# EAGLE design ColorNodeV1.1 (EAGLE 6.3)
ABBREV: jn5; PROJECT: JeeNode v5
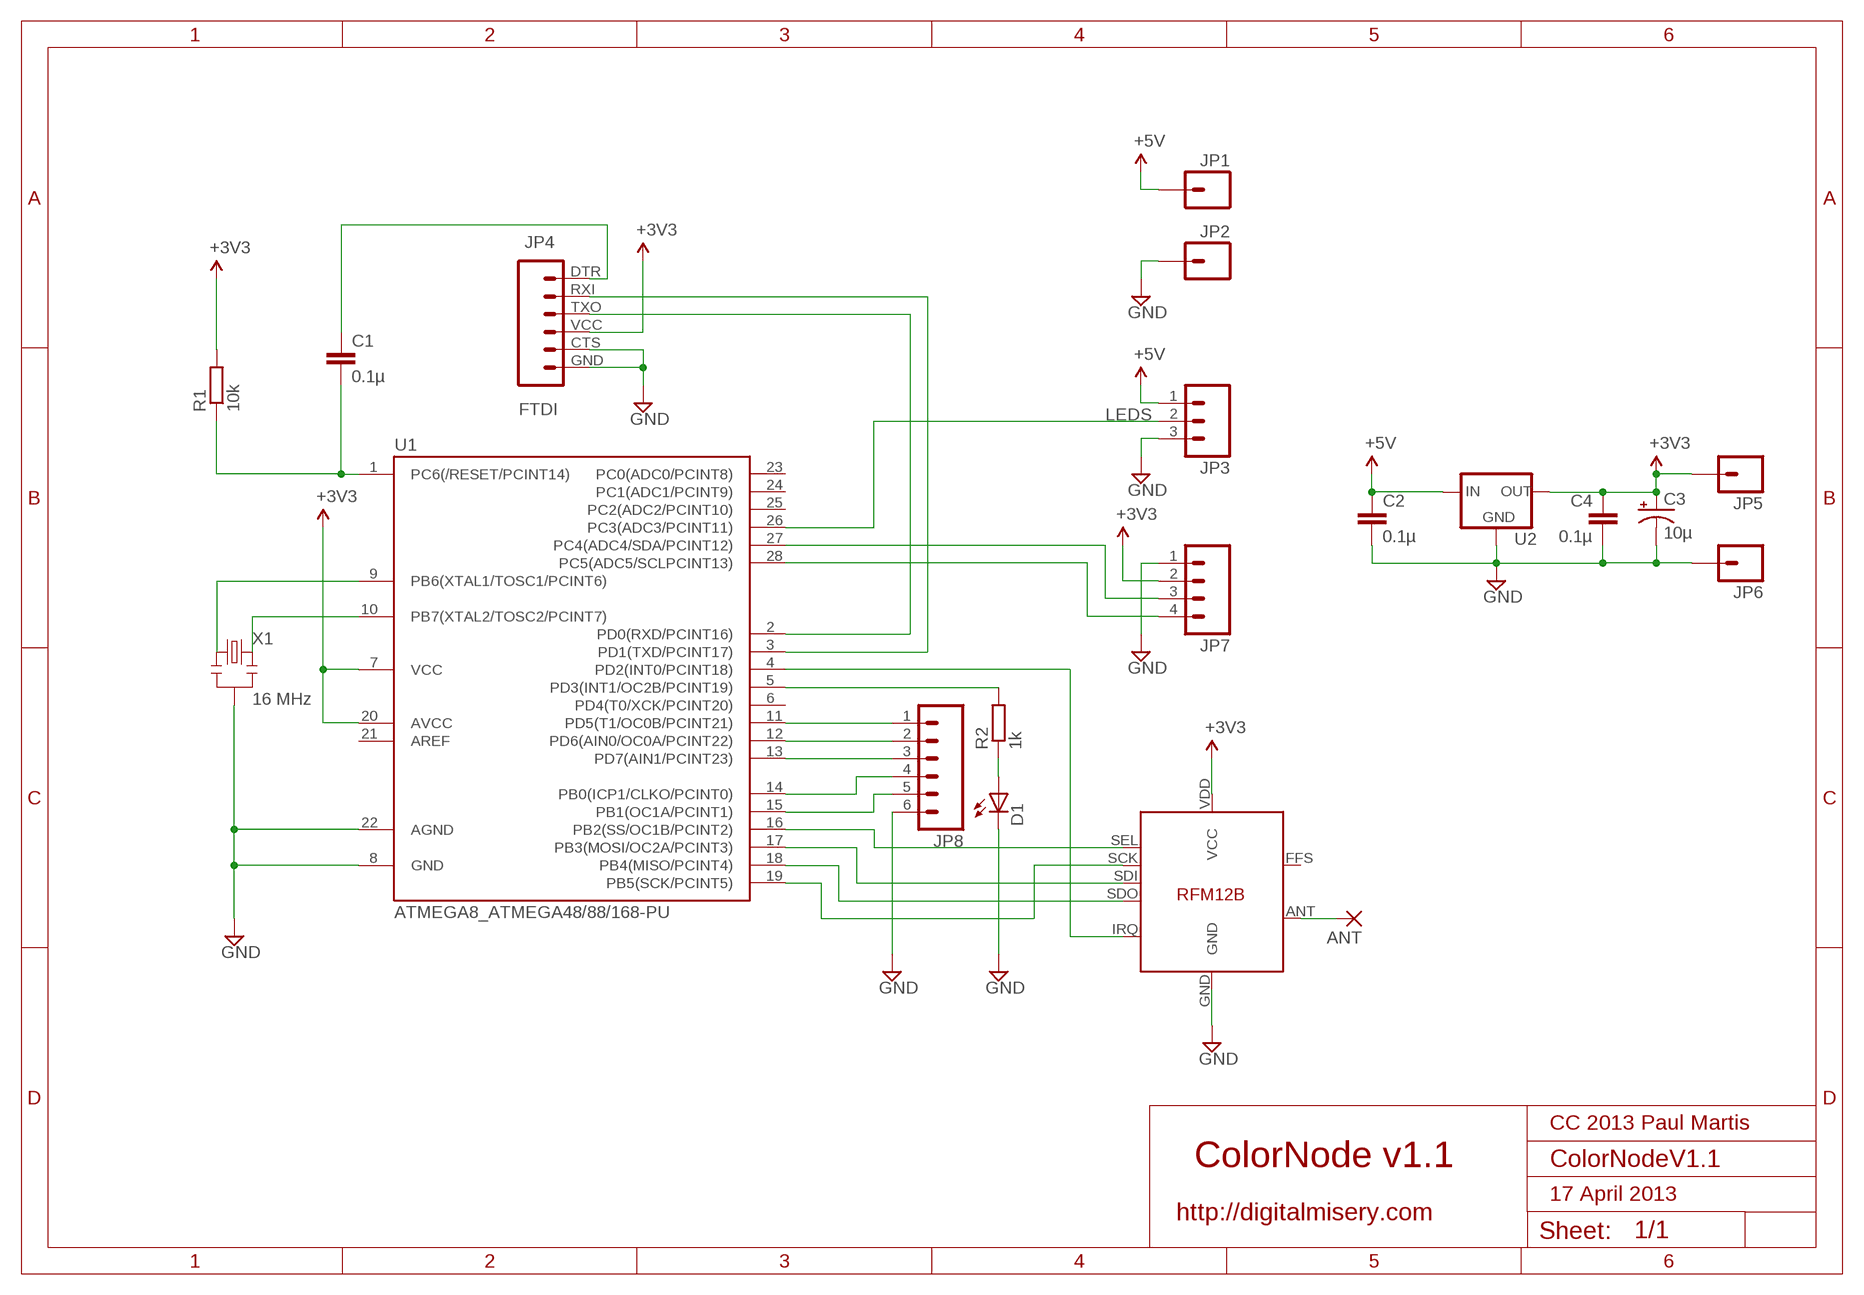
[diagram p0: schematic, sheet 1]

## Parts
ANT  1,6/0,8  [1,6/0,8]
C1  0.1µ  C-EU025-024X044  [C025-024X044]
C2  0.1µ  C-EU025-024X044  [C025-024X044]
C3  10µ  CPOL-USE1.8-4  [E1,8-4]
C4  0.1µ  C-EU025-024X044  [C025-024X044]
D1  LED3MM  [LED3MM]
JP1  M01PTH_2MM  [1X01_2MM]
JP2  M01PTH_2MM  [1X01_2MM]
JP3  M031X03_NO_SILK  [1X03_NO_SILK]
JP4  FTDI  FTDI_BASICPTH  [FTDI_BASIC]
JP5  M01PTH  [1X01]
JP6  M01PTH  [1X01]
JP7  M041X04_NO_SILK  [1X04_NO_SILK]
JP8  M06SIP  [1X06]
R1  10k  R-EU_0204/7  [0204/7]
R2  1k  R-EU_0204/7  [0204/7]
U1  ATMEGA8_ATMEGA48/88/168-PU  [ATMEGA8_DIL28-3]
U2  MCP1700INLINE  [TO92-INLINE]
U3  RFM12B  [RFM12B]
X1  16 MHz  RESONATORPTH  [RESONATOR-PTH]

## Nets
5V [power]: C2.1 JP1.1 JP3.1 U2.2(IN) ; supply symbol labelled +5V
GND [power]: C2.2 C3.- C4.2 D1.K(C) JP2.1 JP3.3 JP4.CTS JP4.GND JP6.1 JP7.1 JP8.6 U1.8(GND) U1.22(AGND) U2.1(GND) U3.GND X1.2
LEDS: JP3.2 U1.26(PC3(ADC3/PCINT11))
N$1: U1.9(PB6(XTAL1/TOSC1/PCINT6)) X1.1
N$2: JP8.2 U1.12(PD6(AIN0/OC0A/PCINT22))
N$3: C1.1 JP4.DTR
N$4: JP8.5 U1.15(PB1(OC1A/PCINT1))
N$5: C1.2 R1.1 U1.1(PC6(/RESET/PCINT14))
N$6: JP4.TXO U1.2(PD0(RXD/PCINT16))
N$7: JP4.RXI U1.3(PD1(TXD/PCINT17))
N$9: U1.17(PB3(MOSI/OC2A/PCINT3)) U3.SDI
N$10: U1.4(PD2(INT0/PCINT18)) U3.IRQ
N$11: U1.18(PB4(MISO/PCINT4)) U3.SDO
N$12: U1.19(PB5(SCK/PCINT5)) U3.SCK
N$13: ANT.1(P) U3.ANT
N$14: U1.16(PB2(SS/OC1B/PCINT2)) U3.SEL
N$15: JP7.3 U1.27(PC4(ADC4/SDA/PCINT12))
N$16: JP7.4 U1.28(PC5(ADC5/SCLPCINT13))
N$17: JP8.4 U1.14(PB0(ICP1/CLKO/PCINT0))
N$18: JP8.3 U1.13(PD7(AIN1/PCINT23))
N$19: JP8.1 U1.11(PD5(T1/OC0B/PCINT21))
N$20: D1.A R2.1
N$21: U1.10(PB7(XTAL2/TOSC2/PCINT7)) X1.3
N$22: R2.2 U1.5(PD3(INT1/OC2B/PCINT19))
VCC [power]: C3.+ C4.1 JP4.VCC JP5.1 JP7.2 R1.2 U1.7(VCC) U1.20(AVCC) U2.3(OUT) U3.VDD(VCC) ; supply symbol labelled +3V3
Unconnected: U1.6(PD4(T0/XCK/PCINT20)) U1.21(AREF) U1.23(PC0(ADC0/PCINT8)) U1.24(PC1(ADC1/PCINT9)) U1.25(PC2(ADC2/PCINT10)) U3.FFS

## Notes on the sheet
- CC 2013 Paul Martis
- ColorNode v1.1
- 17 April 2013
- http://digitalmisery.com

## Library data of the parts
ANT = JeeLabs:1,6/0,8: THROUGH-HOLE PAD
C1 C2 C4 = resistor:C-EU: CAPACITOR, European symbol
C3 = resistor:CPOL-US: POLARIZED CAPACITOR, American symbol
D1 = SparkFun-LED:LED: LEDs Standard schematic elements and footprints for 5mm, 3mm, 1206, and 0603 sized LEDs. 5mm - Spark Fun Electronics SKU : COM-00529 (and others)
JP1 JP2 = SparkFun:M01: Header 1 Standard 1-pin 0.1" header. Use with straight break away headers (SKU : PRT-00116), right angle break away headers (PRT-00553), swiss pins (PRT-00743), machine pins (PRT-00117), and female headers (PRT-00115).
JP3 = SparkFun:M03: Header 3 Standard 3-pin 0.1" header. Use with straight break away headers (SKU : PRT-00116), right angle break away headers (PRT-00553), swiss pins (PRT-00743), machine pins (PRT-00117), and female headers (PRT-00115). Molex polarized connector foot print use with SKU : PRT-08232 with associated crimp pins and housings.
JP4 = SparkFun:FTDI_BASIC: FTDI Basic: 3.3V and 5V
JP5 JP6 = SparkFun-Connectors:M01: Header 1 Standard 1-pin 0.1" header. Use with straight break away headers (SKU : PRT-00116), right angle break away headers (PRT-00553), swiss pins (PRT-00743), machine pins (PRT-00117), and female headers (PRT-00115).
JP7 = SparkFun-Connectors:M04: Header 4 Standard 4-pin 0.1" header. Use with straight break away headers (SKU : PRT-00116), right angle break away headers (PRT-00553), swiss pins (PRT-00743), machine pins (PRT-00117), and female headers (PRT-00115). Molex polarized connector foot print use with SKU : PRT-08231 with associated crimp pins and housings. 1MM SMD Version SKU: PRT-10208
JP8 = SparkFun-Connectors:M06: Header 6 Standard 6-pin 0.1" header. Use with straight break away headers (SKU : PRT-00116), right angle break away headers (PRT-00553), swiss pins (PRT-00743), machine pins (PRT-00117), and female headers (PRT-00115). Molex polarized connector foot print use with SKU : PRT-08094 with associated crimp pins and housings. NOTES ON THE VARIANTS LOCK and LOCK_LONGPADS... This footprint was designed to help hold the alignment of a through-hole component (i.e. 6-pin header) while soldering it into place. You may notice that each hole has been shifted either up or down by 0.005 of an inch from it's more standard position (which is a perfectly straight line). This slight alteration caused the pins (the squares in the middle) to touch the edges of the holes. Because they are alternating, it causes a "brace" to hold the component in place. 0.005 has proven to be the perfect amount of "off-center" position when using our standard breakaway headers. Although looks a little odd when you look at the bare footprint, once you have a header in there, the alteration is very hard to notice. Also, if you push a header all the way into place, it is covered up entirely on the bottom side. This idea of altering the position of holes to aid alignment will be further integrated into the Sparkfun Library for other footprints. It can help hold any component with 3 or more connection pins.
R1 R2 = resistor:R-EU_: RESISTOR, European symbol
U1 = jlpcb-105:ATMEGA8_ATMEGA48/88/168-PU
U2 = adafruit:MCP1700: VOLTAGE REGULATOR
U3 = JeeLabs:RFM12B
X1 = SparkFun:RESONATOR: Resonator Small SMD resonator. This is the itty bitty 10/20MHz resonators with built in caps. CSTCE10M0G55 and CSTCE20M0V53. Footprint has been reviewed closely but hasn't been tested yet.

## Net classes
1 power: width 0.381 mm, clearance 0.254 mm

## Board
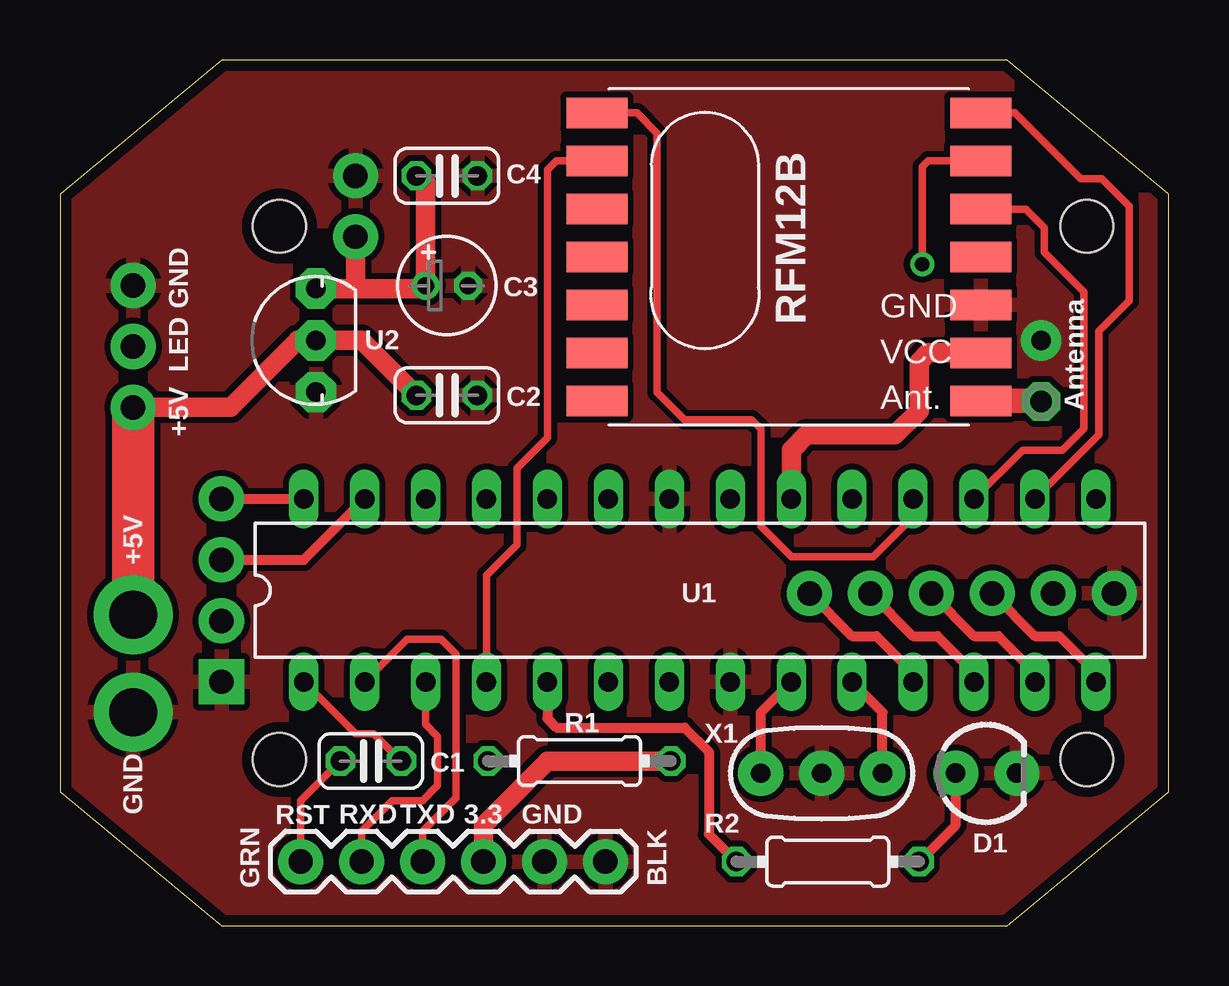
[diagram p1: board, top side]
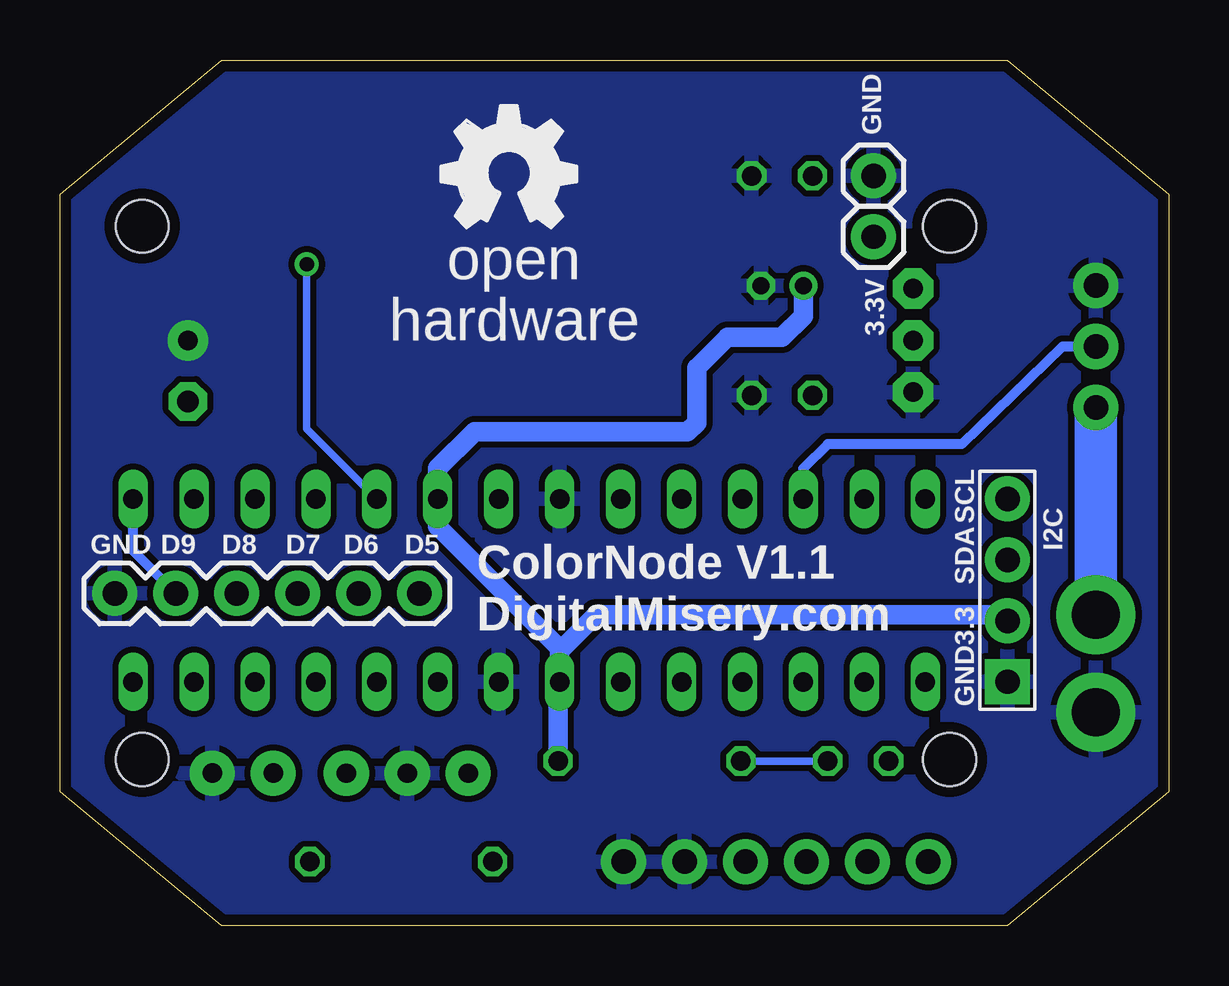
[diagram p2: board, bottom side, seen from below]

Size 46.23 x 36.07 mm. Coordinates in mm from the lower left corner, seen from the top.
Outline: 6.73,0 39.5,0 46.23,5.59 46.23,30.48 39.5,36.07 6.73,36.07 0,30.48 0,5.59 6.73,0
Copper layers (1*16): Top 0.035mm / dielectric 1.5mm / Bottom 0.035mm
Design rules "10mils *": minimum track width 8mil, minimum drill 0.4mm, track to track 8mil, track to pad 8mil, pad to pad 8mil, via to via 8mil, smd to smd 8mil, copper to edge 18mil, drill to drill 0.4mm, minimum pad ring 0.15mm, minimum via ring 8mil, stop-mask expansion 4mil, vias tented up to drill 20mil, thermal gap 10mil
Holes 2.2 mm at 9.14,29.15 9.14,6.92 42.8,6.92 42.8,29.15

### Footprints (pad centres in the part's own frame; a part is rotated, then mirrored left to right if it is on the bottom)
1,6/0,8 = drill 0.9 pad 1.6 octagon: 1 0,0
C025-024X044 = drill 0.813 octagon: 1 -1.27,0; 2 1.27,0
E1,8-4 = drill 0.711 pad 1.168: + -0.889,0 | drill 0.711 pad 1.168 octagon: - 0.889,0
LED3MM = drill 0.813 pad 1.88: A -1.27,0; K 1.27,0
1X01_2MM = drill 2 pad 3.302: 1 0,0
1X03_NO_SILK = drill 1.016 pad 1.88: 1 0,0; 2 2.54,0; 3 5.08,0
FTDI_BASIC = drill 1.016 pad 1.88: CTS 10.16,0; DTR 0,0; GND 12.7,0; RXI 2.54,0; TXO 5.08,0; VCC 7.62,0
1X01 = drill 1.016 pad 1.88: 1 0,0
1X04_NO_SILK = drill 1.016 pad 1.88 square: 1 0,0 | drill 1.016 pad 1.88: 2 2.54,0; 3 5.08,0; 4 7.62,0
1X06 = drill 1.016 pad 1.88: 1 0,0; 2 2.54,0; 3 5.08,0; 4 7.62,0; 5 10.16,0; 6 12.7,0
0204/7 = drill 0.813 octagon: 1 -3.81,0; 2 3.81,0
ATMEGA8_DIL28-3 = drill 0.813 long: 1 -16.51,-3.81; 2 -13.97,-3.81; 3 -11.43,-3.81; 4 -8.89,-3.81; 5 -6.35,-3.81; 6 -3.81,-3.81; 7 -1.27,-3.81; 8 1.27,-3.81; 9 3.81,-3.81; 10 6.35,-3.81; 11 8.89,-3.81; 12 11.43,-3.81; 13 13.97,-3.81; 14 16.51,-3.81; 15 16.51,3.81; 16 13.97,3.81; 17 11.43,3.81; 18 8.89,3.81; 19 6.35,3.81; 20 3.81,3.81; 21 1.27,3.81; 22 -1.27,3.81; 23 -3.81,3.81; 24 -6.35,3.81; 25 -8.89,3.81; 26 -11.43,3.81; 27 -13.97,3.81; 28 -16.51,3.81
TO92-INLINE = drill 0.813 pad 1.676 octagon: 1 -2.159,0; 2 0,0; 3 2.159,0
RFM12B = smd 2.54 x 1.27: ANT 8,-6; FFS -8,2; GND 8,-2; IRQ -8,4; P$8 -8,0; P$9 -8,-2; P$10 -8,-4; P$12 -8,-6; P$16 8,0; SCK 8,4; SDI 8,2; SDO -8,6; SEL 8,6; VDD 8,-4
RESONATOR-PTH = drill 0.8 pad 1.88: 1 -2.54,0; 2 0,0; 3 2.54,0

### Placement (x,y rotation side)
ANT  40.89,21.84 270 top
C1  12.95,6.86 0 top
C2  16.13,22.1 0 top
C3  16.13,26.67 0 top
C4  16.13,31.24 0 top
D1  38.61,6.35 0 top
E$2  [OSHW_FILLX200_NOTEXT]  30.35,29.08 0 bottom
JP1  3.05,12.95 90 top
JP2  3.05,8.89 90 top
JP3  3.05,21.59 90 top
JP4  10.03,2.67 0 top
JP5  12.32,28.7 0 bottom
JP6  12.32,31.24 0 bottom
JP7  6.73,10.16 90 top
JP8  31.24,13.84 180 bottom
R1  21.65,6.86 0 top
R2  32,2.67 180 top
U1  26.67,13.97 0 top
U2  10.67,24.38 90 top
U3  30.38,27.86 0 top
X1  31.75,6.35 0 top

### Tracks (layer width: path | path; a pad name or v marks a point on that pad's centre or on a via)
5V
  Top 0.813: JP3.1 7.11,21.59 9.91,24.38 U2.2 12.57,24.38 C2.1
  Top 1.778: JP1.1 JP3.1
  Bottom 1.778: JP1.1 JP3.1
GND  (via drill 0.8 pad 1.68)
  other vias: 40.89,24.38
  pour Bottom: 0,30.48 6.73,36.07 39.5,36.07 46.23,30.48 46.23,5.59 39.37,0 6.6,0 0,5.59
  pour Top: 0,30.48 6.73,36.07 39.5,36.07 46.23,30.48 46.23,5.59 39.37,0 6.6,0 0,5.59
LEDS
  Bottom 0.406: JP3.2 4.45,24.13 8.64,20.07 14.22,20.07 15.24,19.05 U1.26
N$1
  Top 0.406: X1.1 29.21,8.89 U1.9
N$2
  Top 0.406: JP8.2 35.56,12.06 36.58,12.06 38.1,10.54 U1.12
N$3
  Top 0.305: JP4.DTR 10.03,5.21 C1.1
N$4
  Bottom 0.406: JP8.5 43.18,15.62 U1.15
N$5
  Top 0.305: U1.1 12.32,8 13.08,8 C1.2
  Bottom 0.305: C1.2 R1.1
N$6
  Top 0.305: JP4.TXO 15.11,3.94 16.51,5.33 16.51,11.3 15.88,11.94 14.48,11.94 U1.2
N$7
  Top 0.305: U1.3 15.24,8.38 15.75,7.87 15.75,5.84 15.11,5.21 13.84,5.21 12.57,3.94 JP4.RXI
N$9
  Top 0.305: U3.SDI 38.4,29.84 40.26,29.84 41.02,29.08 41.02,28.07 42.67,26.42 42.67,20.7 41.78,19.81 40.13,19.81 U1.17
N$10
  Top 0.305: U3.IRQ 20.69,31.86 20.32,31.5 20.32,20.32 19.05,19.05 19.05,15.88 17.78,14.61 U1.4
N$11
  Top 0.305: U1.18 35.56,17.02 33.91,15.37 30.48,15.37 29.21,16.64 29.21,20.7 28.83,21.08 26.04,21.08 24.89,22.23 24.89,33.02 24.05,33.86 U3.SDO
N$12  (via drill 0.6)
  Top 0.305: U3.SCK 38.37,31.88 36.2,31.88 35.94,31.62 v35.94,27.56
  Bottom 0.305: v35.94,27.56 35.94,20.7 U1.19
N$13
  Top 0.813: ANT.1 40.75,21.86
  Top 1.016: 40.75,21.86 U3.ANT
N$14
  Top 0.305: U1.16 43.31,20.45 43.31,24.77 44.58,26.04 44.58,29.97 43.43,31.11 42.55,31.11 39.8,33.86 U3.SEL
N$15
  Top 0.406: JP7.3 10.16,15.24 U1.27
N$16
  Top 0.406: JP7.4 U1.28
N$17
  Top 0.406: JP8.4 40.64,12.06 41.66,12.06 43.18,10.54 U1.14
N$18
  Top 0.406: JP8.3 38.1,12.06 39.12,12.06 40.64,10.54 U1.13
N$19
  Top 0.406: JP8.1 33.02,12.06 34.04,12.06 35.56,10.54 U1.11
N$20
  Top 0.406: R2.1 37.34,4.19 D1.A
N$21
  Top 0.406: X1.3 34.29,8.89 U1.10
N$22
  Top 0.406: U1.5 20.32,8.64 20.7,8.26 26.04,8.26 27.05,7.24 27.05,3.81 R2.2
VCC
  Top 0.813: U1.20 30.48,19.81 31.11,20.45 34.8,20.45 35.81,21.46 35.81,23.5 36.18,23.86 U3.VDD | U1.7 25.46,10.1 | JP4.VCC 17.65,4.19 20.32,6.86 R1.2 | 12.19,26.54 U2.3 10.54,26.67 | 12.19,26.54 15.11,26.54 C3.+ 15.24,30.99 C4.1 | JP5.1 12.32,26.67 12.19,26.54
  Bottom 0.813: C3.+ 15.24,25.4 16.13,24.51 18.41,24.51 19.68,23.24 19.68,20.95 20.07,20.57 28.96,20.57 30.48,19.05 U1.20 30.48,16.64 25.4,11.56 25.4,11.43 | 25.4,11.43 U1.7 25.46,10.1 R1.2 | 25.4,11.43 23.88,12.95 6.99,12.95 JP7.2

### Text on the board
tPlace: Antenna
bPlace: open | hardware | ColorNode V1.1 | DigitalMisery.com
tNames: RFM12B | C4 | GND | C3 | U2 | LED | C2 | +5V | +5V | U1 | R1 | X1 | C1 | GND | RST | RXD | TXD | 3.3 | GND | R2 | D1 | GRN | BLK
bNames: GND | 3.3V | SCL | I2C | D5 | D6 | D7 | D8 | D9 | GND | SDA | 3.3 | GND